# Altium schematic sheet CW340_FTDI_LevelShifting.SchDoc: <Enter Sheet Title>
size Letter; Organization: NewAE Technology Inc.; Address1: 1083 Queen St., Suite 196; Address2: Halifax; Address3: NS; Address4: Canada B3H 0B2; SheetApproved: NO
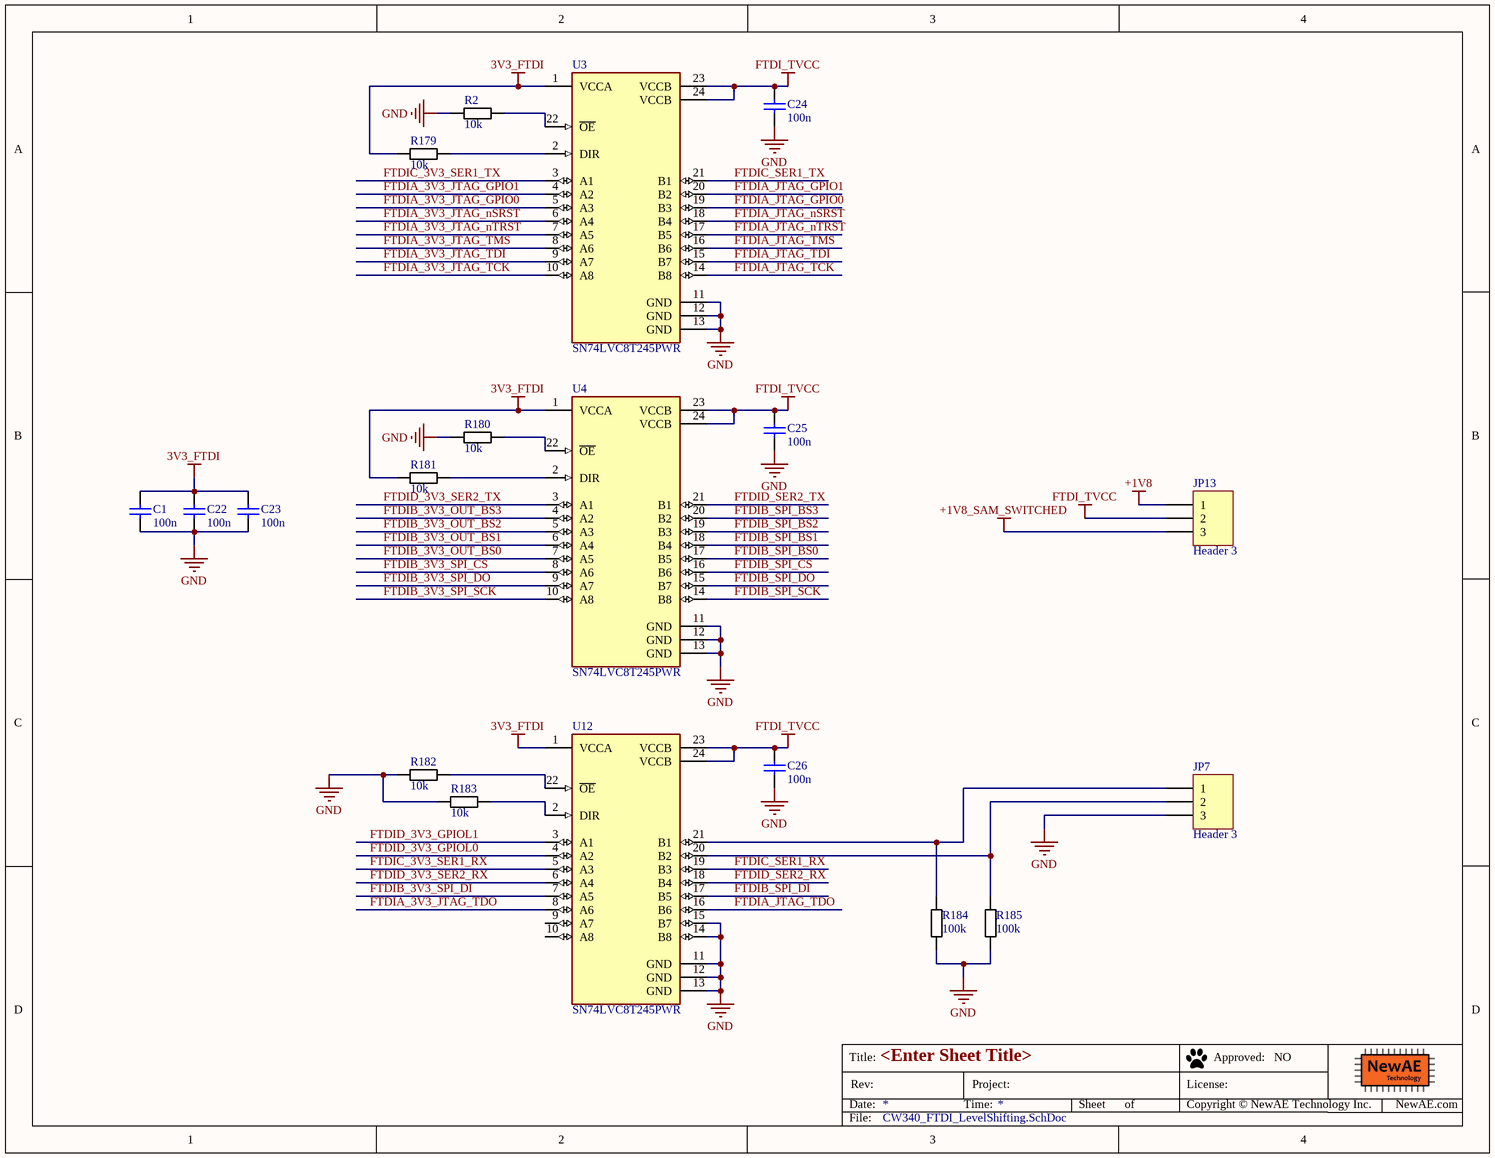
[diagram p0: CW340_FTDI_LevelShifting.SchDoc]

## Parts
C1  100n  [CAPC0402_M]
C22  100n  [CAPC0402_M]
C23  100n  [CAPC0402_M]
C24  100n  [CAPC0402_M]
C25  100n  [CAPC0402_M]
C26  100n  [CAPC0402_M]
JP7  Header 3  [HDR1X3]
JP13  Header 3  [HDR1X3]
R2  10k  [RESC1005X40N]
R179  10k  [RESC1005X40N]
R180  10k  [RESC1005X40N]
R181  10k  [RESC1005X40N]
R182  10k  [RESC1005X40N]
R183  10k  [RESC1005X40N]
R184  100k  [RESC1608X55N]
R185  100k  [RESC1608X55N]
U3  SN74LVC8T245PWR  [FP-PW0024A-MFG]
U4  SN74LVC8T245PWR  [FP-PW0024A-MFG]
U12  SN74LVC8T245PWR  [FP-PW0024A-MFG]

## Nets
3V3_FTDI: C1.1 C22.1 C23.1 R179.2 R181.2 U3.1(VCCA) U4.1(VCCA) U12.1(VCCA)
+1V8: JP13.1
+1V8_SAM_SWITCHED: JP13.3
FTDI_TVCC: C24.1 C25.1 C26.1 JP13.2 U3.23(VCCB) U3.24(VCCB) U4.23(VCCB) U4.24(VCCB) U12.23(VCCB) U12.24(VCCB)
GND: C1.2 C22.2 C23.2 C24.2 C25.2 C26.2 JP7.3 R2.2 R180.2 R182.2 R183.2 R184.2 R185.2 U3.11(GND) U3.12(GND) U3.13(GND) U4.11(GND) U4.12(GND) U4.13(GND) U12.11(GND) U12.12(GND) U12.13(GND) U12.14(B8) U12.15(B7)
FTDIA_3V3_JTAG_GPIO0: U3.5(A3)
FTDIA_3V3_JTAG_GPIO1: U3.4(A2)
FTDIA_3V3_JTAG_nSRST: U3.6(A4)
FTDIA_3V3_JTAG_nTRST: U3.7(A5)
FTDIA_3V3_JTAG_TCK: U3.10(A8)
FTDIA_3V3_JTAG_TDI: U3.9(A7)
FTDIA_3V3_JTAG_TDO: U12.8(A6)
FTDIA_3V3_JTAG_TMS: U3.8(A6)
FTDIA_JTAG_GPIO0: U3.19(B3)
FTDIA_JTAG_GPIO1: U3.20(B2)
FTDIA_JTAG_nSRST: U3.18(B4)
FTDIA_JTAG_nTRST: U3.17(B5)
FTDIA_JTAG_TCK: U3.14(B8)
FTDIA_JTAG_TDI: U3.15(B7)
FTDIA_JTAG_TDO: U12.16(B6)
FTDIA_JTAG_TMS: U3.16(B6)
FTDIB_3V3_OUT_BS0: U4.7(A5)
FTDIB_3V3_OUT_BS1: U4.6(A4)
FTDIB_3V3_OUT_BS2: U4.5(A3)
FTDIB_3V3_OUT_BS3: U4.4(A2)
FTDIB_3V3_SPI_CS: U4.8(A6)
FTDIB_3V3_SPI_DI: U12.7(A5)
FTDIB_3V3_SPI_DO: U4.9(A7)
FTDIB_3V3_SPI_SCK: U4.10(A8)
FTDIB_SPI_BS0: U4.17(B5)
FTDIB_SPI_BS1: U4.18(B4)
FTDIB_SPI_BS2: U4.19(B3)
FTDIB_SPI_BS3: U4.20(B2)
FTDIB_SPI_CS: U4.16(B6)
FTDIB_SPI_DI: U12.17(B5)
FTDIB_SPI_DO: U4.15(B7)
FTDIB_SPI_SCK: U4.14(B8)
FTDIC_3V3_SER1_RX: U12.5(A3)
FTDIC_3V3_SER1_TX: U3.3(A1)
FTDIC_SER1_RX: U12.19(B3)
FTDIC_SER1_TX: U3.21(B1)
FTDID_3V3_GPIOL0: U12.4(A2)
FTDID_3V3_GPIOL1: U12.3(A1)
FTDID_3V3_SER2_RX: U12.6(A4)
FTDID_3V3_SER2_TX: U4.3(A1)
FTDID_SER2_RX: U12.18(B4)
FTDID_SER2_TX: U4.21(B1)
NetJP7_1: JP7.1 R184.1 U12.21(B1)
NetJP7_2: JP7.2 R185.1 U12.20(B2)
NetR2_1: R2.1 U3.22(~{OE})
NetR179_1: R179.1 U3.2(DIR)
NetR180_1: R180.1 U4.22(~{OE})
NetR181_1: R181.1 U4.2(DIR)
NetR182_1: R182.1 U12.22(~{OE})
NetR183_1: R183.1 U12.2(DIR)

Not connected (* = marked no-connect by the designer): U12 9(A7) 10(A8)

## Notes on the sheet
- Title:
- Date:
- Rev:
- Time:
- Project:
- Sheet
- of
- License:
- Copyright © NewAE Technology Inc.
- Approved:
- NewAE.com
- File:

## Library data of the parts
C1 C22-C26 = CCHIP-100n-0402: 100n, 0402; Manufacture Part Number 1: CGA2B3X7R1V104K050BB; Component Group: Capacitor; Case-EIA: 0402; Part Number: CCHIP-100n-0402; Footprint: 0402; Pin Count: 2; Supplier 1: Digi-Key; Supplier Part Number 1: 445-6901-1-ND; Value: 100n; Mounting Technology: SMT; Component Kind: Standard; Component Type: Standard
JP7 JP13 = Header 3: Header, 3-Pin; LatestRevisionDate: 17-Jul-2002; LatestRevisionNote: Re-released for DXP Platform.; Publisher: Altium Limited
R2 R179-R183 = RCHIP-10K-0402: 10k res, 0402, 1%, 1/16W; Manufacture 1: Yageo; Manufacture Part Number 1: RC0402FR-0710KL; Component Group: Resistor; Case-EIA: 0402; Case-Metric: 1005; Rated Power: 0.063W; Rated Voltage: 75VDC; Part Number: RCHIP-10K-0402; Footprint: 0402; Pin Count: 2; Supplier 1: Digi-Key; Supplier Part Number 1: 311-10.0KLRCT-ND; Value: 10k; Tolerance: 1%; Mounting Technology: SMT; Temperature Range: -55C to 155C; Component Kind: Standard; Component Type: Standard
R184 R185 = RCHIP-100K-0603: 100k res, 0603, 1%, 1/10W; Manufacture 1: Yageo; Manufacture Part Number 1: RC0603FR-07100KL; Component Group: Resistor; Case-EIA: 0603; Case-Metric: 1608; Rated Power: 0.1W; Rated Voltage: 75VDC; Part Number: RCHIP-100K-0603; Footprint: 0603; Pin Count: 2; Supplier 1: Digi-Key; Supplier Part Number 1: 311-100KHRCT-ND; Value: 100k; Tolerance: 1%; Mounting Technology: SMT; Temperature Range: -55C to 155C; Component Kind: Standard; Component Type: Standard
U3 U4 U12 = CMP-04899-000027-1: IC TRNSLTR BIDIRECTIONAL 24TSSOP; Manufacturer: Texas Instruments; V B Min: 1.65V; V B Max: 5.5V; Number Of Outputs: 8; Standoff Height: 0.05mm; Nominal Supply Current: 25uA; Number Of Circuits: 1; Propagation Delay: 4.3ns; Logic Function Desc: Non-Inverting; Ambient Temperature Range High: +85°C; Temperature Range Low: -40°C; Category: IC; Min Supply Voltage: 1.65V; Device Class L2: Logic ICs; Digikey Description: IC TRNSLTR BIDIRECTIONAL 24TSSOP; ComponentLink2Description: Datasheet; V A Min: 1.65V; Height: 1.2mm; Device Class L1: Integrated Circuits (ICs); Manufacturer Part Number: SN74LVC8T245PWR; Ipc Land Pattern Name: SOP65P640X120-24; Lead Free: Yes; Device Class L3: Voltage Level Shifters; Octopart: https://octopart.com/sn74lvc8t245pwr-texas+instruments-517164; RoHS: TRUE; Ambient Temperature Range Low: -40°C; Number Of Inputs: 8; Automotive: No; V A Max: 5.5V; Mouser Description: Translation - Voltage Levels 8-Bit Dual-Supply Bus Xcvr; Temperature Range High: +85°C; ComponentLink2URL: http://www.ti.com/lit/ds/symlink/sn74lvc8t245.pdf; Temperature: -40°C to +85°C; Package: PW0024A; Max Supply Voltage: 5.5V